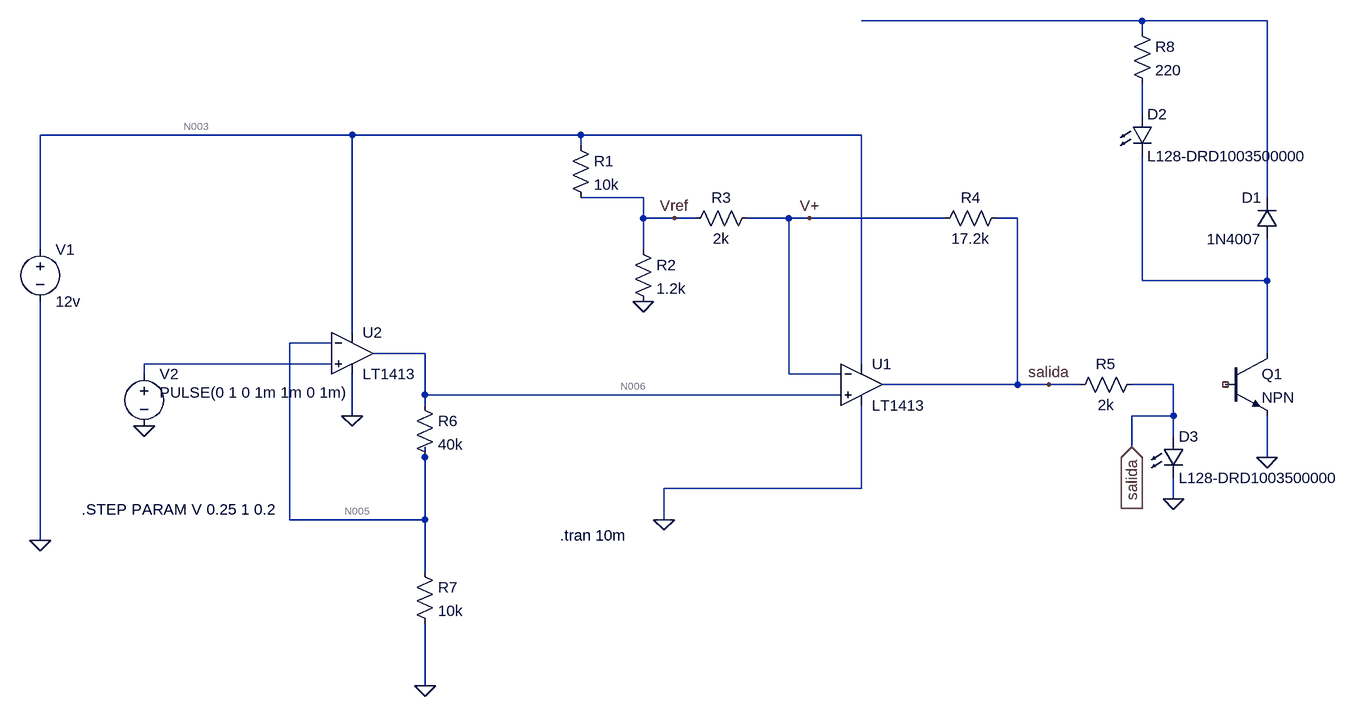
[diagram p0: schematic Draft1.asc]
Draft1.asc, the LTspice schematic file:
Version 4
SHEET 1 1060 680
WIRE 736 -368 304 -368
WIRE 928 -368 736 -368
WIRE 736 -352 736 -368
WIRE 736 -224 736 -272
WIRE -480 -192 -960 -192
WIRE -128 -192 -480 -192
WIRE 304 -192 -128 -192
WIRE -128 -176 -128 -192
WIRE -32 -96 -128 -96
WIRE 928 -96 928 -368
WIRE -32 -64 -32 -96
WIRE 16 -64 -32 -64
WIRE 48 -64 16 -64
WIRE 192 -64 128 -64
WIRE 224 -64 192 -64
WIRE 432 -64 224 -64
WIRE 544 -64 512 -64
WIRE -960 -16 -960 -192
WIRE -32 -16 -32 -64
WIRE 736 32 736 -160
WIRE 928 32 928 -32
WIRE 928 32 736 32
WIRE -480 112 -480 -192
WIRE -512 128 -576 128
WIRE -368 144 -448 144
WIRE 928 144 928 32
WIRE -512 160 -800 160
WIRE 304 160 304 -192
WIRE -800 176 -800 160
WIRE 192 176 192 -64
WIRE 272 176 192 176
WIRE 544 192 544 -64
WIRE 544 192 336 192
WIRE 592 192 544 192
WIRE 640 192 592 192
WIRE 784 192 720 192
WIRE -368 208 -368 144
WIRE 272 208 -368 208
WIRE -368 224 -368 208
WIRE -480 240 -480 176
WIRE 784 240 784 192
WIRE 784 240 720 240
WIRE 784 272 784 240
WIRE 720 288 720 240
WIRE -368 304 -368 288
WIRE 928 304 928 240
WIRE 304 352 304 224
WIRE 304 352 0 352
WIRE 784 368 784 336
WIRE -576 400 -576 128
WIRE -368 400 -368 304
WIRE -368 400 -576 400
WIRE 0 400 0 352
WIRE -960 432 -960 64
WIRE -368 480 -368 400
WIRE -368 656 -368 560
FLAG 0 400 0
FLAG 592 192 salida
FLAG 16 -64 Vref
FLAG 224 -64 V+
FLAG -368 656 0
FLAG -480 240 0
FLAG -960 432 0
FLAG -800 256 0
FLAG 928 304 0
FLAG 784 368 0
FLAG 720 288 salida
IOPIN 720 288 In
FLAG -32 64 0
SYMBOL res -144 -192 R0
SYMATTR InstName R1
SYMATTR Value 10k
SYMBOL res -48 -32 R0
SYMATTR InstName R2
SYMATTR Value 1.2k
SYMBOL res 144 -80 R90
WINDOW 0 0 56 VBottom 2
WINDOW 3 32 56 VTop 2
SYMATTR InstName R3
SYMATTR Value 2k
SYMBOL res 528 -80 R90
WINDOW 0 0 56 VBottom 2
WINDOW 3 32 56 VTop 2
SYMATTR InstName R4
SYMATTR Value 17.2k
SYMBOL res 736 176 R90
WINDOW 0 0 56 VBottom 2
WINDOW 3 32 56 VTop 2
SYMATTR InstName R5
SYMATTR Value 2k
SYMBOL voltage -800 160 R0
WINDOW 3 24 44 Left 2
WINDOW 123 0 0 Left 0
WINDOW 39 0 0 Left 0
SYMATTR Value PULSE(0 1 0 1m 1m 0 1m)
SYMATTR InstName V2
SYMBOL res -384 208 R0
SYMATTR InstName R6
SYMATTR Value 40k
SYMBOL res -384 464 R0
SYMATTR InstName R7
SYMATTR Value 10k
SYMBOL npn 864 144 R0
SYMATTR InstName Q1
SYMBOL diode 944 -32 R180
WINDOW 0 24 64 Left 2
WINDOW 3 24 0 Left 2
SYMATTR InstName D1
SYMATTR Value 1N4007
SYMBOL LED 720 -224 R0
SYMATTR InstName D2
SYMATTR Value L128-DRD1003500000
SYMBOL res 720 -368 R0
SYMATTR InstName R8
SYMATTR Value 220
SYMBOL LED 768 272 R0
SYMATTR InstName D3
SYMATTR Value L128-DRD1003500000
SYMBOL voltage -960 -32 R0
WINDOW 123 0 0 Left 0
WINDOW 39 0 0 Left 0
SYMATTR InstName V1
SYMATTR Value 12v
SYMBOL OpAmps\\LT1413 304 128 R0
SYMATTR InstName U1
SYMBOL OpAmps\\LT1413 -480 80 R0
SYMATTR InstName U2
TEXT -160 424 Left 2 !.tran 10m
TEXT -896 384 Left 2 !.STEP PARAM V 0.25 1 0.2

The netlist it stands for:
* Draft1.asc
R1 N003 Vref 10k
R2 Vref 0 1.2k
R3 V+ Vref 2k
R4 salida V+ 17.2k
R5 salida salida 2k
V2 N007 0 PULSE(0 1 0 1m 1m 0 1m)
R6 N006 N005 40k
R7 N005 0 10k
Q1 N004 NC_01 0 0 NPN
D1 N004 N001 1N4007
D2 N002 N004 L128-DRD1003500000
R8 N001 N002 220
D3 salida 0 L128-DRD1003500000
V1 N003 0 12v
XU1 N006 V+ N003 0 salida LT1413  ; pins In+ In- V+ V- OUT
XU2 N007 N005 N003 0 N006 LT1413  ; pins In+ In- V+ V- OUT
.model D D
.lib standard.dio
.model NPN NPN
.model PNP PNP
.lib standard.bjt
.tran 10m
.STEP PARAM V 0.25 1 0.2
.lib LTC.lib
.backanno
.end

* Results of the author's LTspice run, read from the files saved beside the schematic
* Operating Point (first step), zero values left out:
*   v = 250 m
*   V(n003) = 12 V
*   V(vref) = 1.221 V
*   V(v+) = 1.101 V
*   V(salida) = 68.71 mV
*   V(n006) = 83.77 mV
*   V(n005) = 16.85 mV
*   I(R1) = 1.078 mA
*   I(R2) = 1.018 mA
*   I(R3) = -60.03 µA
*   I(R4) = -60.04 µA
*   I(R6) = 1.673 µA
*   I(R7) = 1.685 µA
*   I(V2) = 12.64 nA
*   I(V1) = -1.719 mA
*   Ix(u1:1) = -14.93 nA
*   Ix(u1:2) = -10.15 nA
*   Ix(u1:3) = 295.1 µA
*   Ix(u1:4) = -353.7 µA
*   Ix(u1:5) = 60.04 µA
*   Ix(u2:1) = -12.64 nA
*   Ix(u2:2) = -12.56 nA
*   Ix(u2:3) = 345.9 µA
*   Ix(u2:4) = -343.8 µA
*   Ix(u2:5) = -1.658 µA
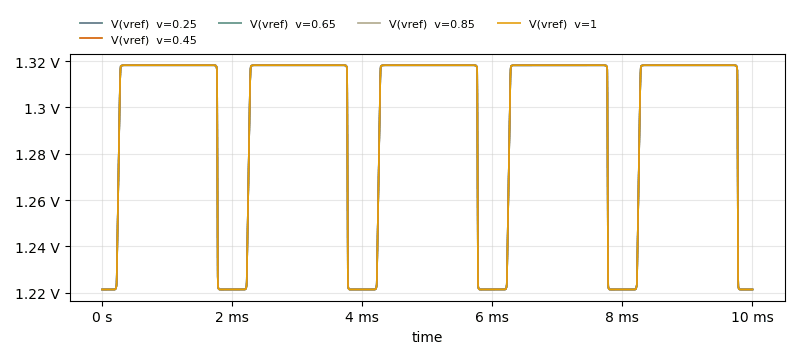
[diagram p1: Transient Analysis of Draft1.asc, plotted from the saved traces]
* Transient Analysis, 5 runs:
*   V(vref) [v=0.25]: min 1.221 V, max 1.318 V, average 1.295 V, rms 1.296 V, last 1.221 V
*   V(vref) [v=0.45]: min 1.221 V, max 1.318 V, average 1.295 V, rms 1.296 V, last 1.221 V
*   V(vref) [v=0.65]: min 1.221 V, max 1.318 V, average 1.295 V, rms 1.296 V, last 1.221 V
*   V(vref) [v=0.85]: min 1.221 V, max 1.318 V, average 1.295 V, rms 1.296 V, last 1.221 V
*   V(vref) [v=1]: min 1.221 V, max 1.318 V, average 1.295 V, rms 1.296 V, last 1.221 V